# EAGLE design untitled (EAGLE 7.2.0)
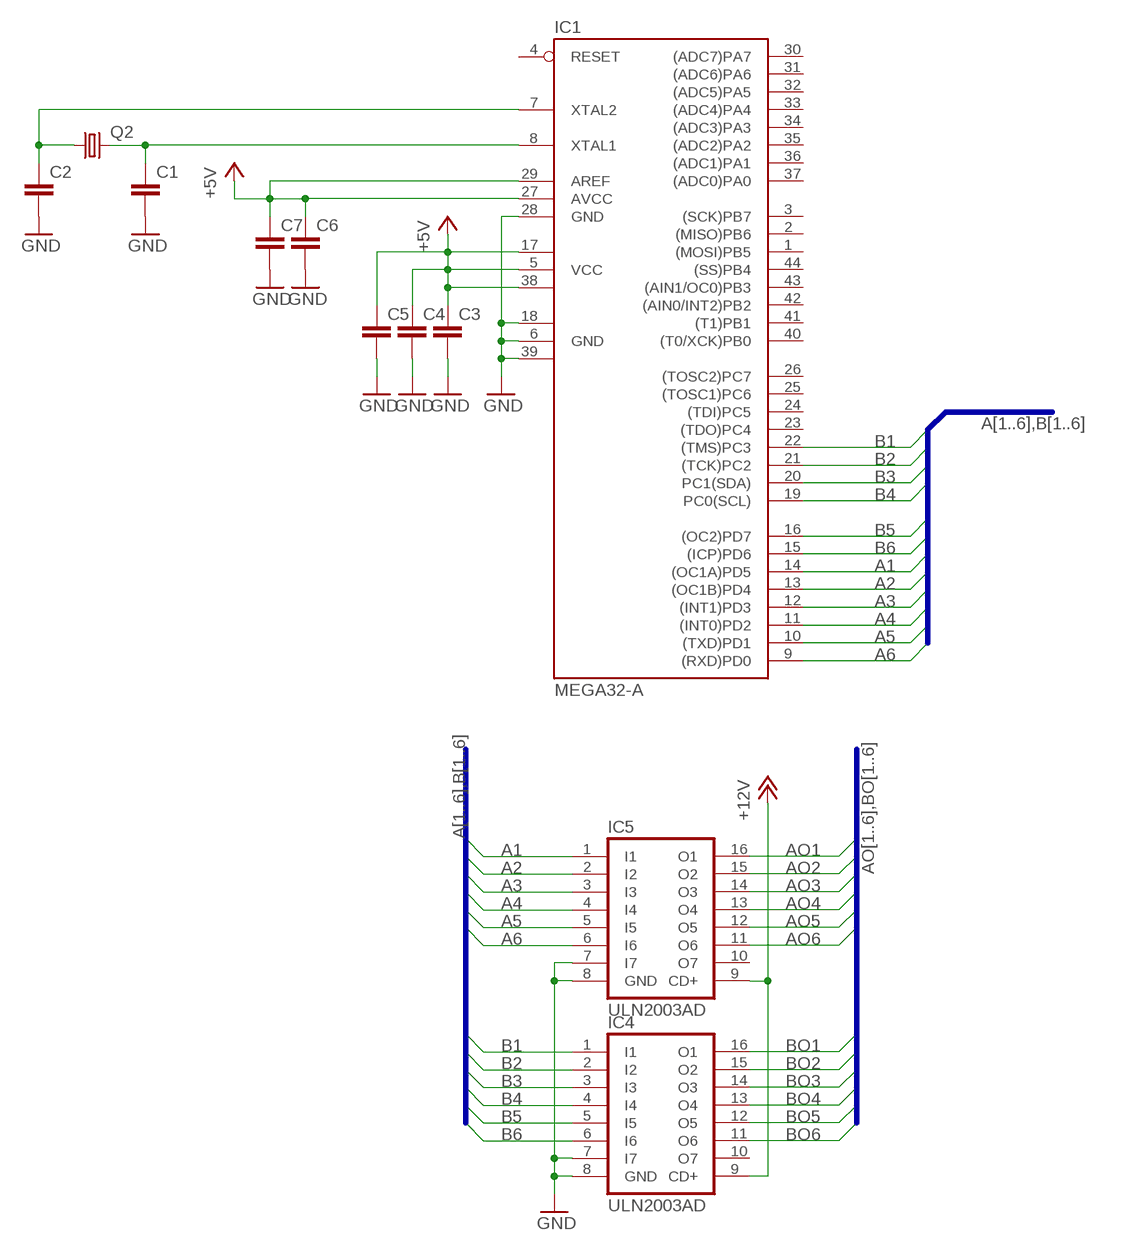
[diagram p0: schematic, sheet 1]

## Parts
C1  C-EUC0805K  [C0805K]
C2  C-EUC0805K  [C0805K]
C3  C-EUC0805K  [C0805K]
C4  C-EUC0805K  [C0805K]
C5  C-EUC0805K  [C0805K]
C6  C-EUC0805K  [C0805K]
C7  C-EUC0805K  [C0805K]
IC1  MEGA32-A  [TQFP44]
IC4  ULN2003AD  [SO16]
IC5  ULN2003AD  [SO16]
Q2  CRYSTALSM49  [SM49]

## Nets
+5V: C3.1 C4.1 C5.1 C6.1 C7.1 IC1.5(VCC) IC1.17(VCC1) IC1.27(AVCC) IC1.29(AREF) IC1.38(VCC2)
+12V: IC4.9(CD+) IC5.9(CD+)
A1: IC1.14((OC1A)PD5) IC5.1(I1)
A2: IC1.13((OC1B)PD4) IC5.2(I2)
A3: IC1.12((INT1)PD3) IC5.3(I3)
A4: IC1.11((INT0)PD2) IC5.4(I4)
A5: IC1.10((TXD)PD1) IC5.5(I5)
A6: IC1.9((RXD)PD0) IC5.6(I6)
AO1: IC5.16(O1)
AO2: IC5.15(O2)
AO3: IC5.14(O3)
AO4: IC5.13(O4)
AO5: IC5.12(O5)
AO6: IC5.11(O6)
B1: IC1.22((TMS)PC3) IC4.1(I1)
B2: IC1.21((TCK)PC2) IC4.2(I2)
B3: IC1.20(PC1(SDA)) IC4.3(I3)
B4: IC1.19(PC0(SCL)) IC4.4(I4)
B5: IC1.16((OC2)PD7) IC4.5(I5)
B6: IC1.15((ICP)PD6) IC4.6(I6)
BO1: IC4.16(O1)
BO2: IC4.15(O2)
BO3: IC4.14(O3)
BO4: IC4.13(O4)
BO5: IC4.12(O5)
BO6: IC4.11(O6)
GND: C1.2 C2.2 C3.2 C4.2 C5.2 C6.2 C7.2 IC1.6(GND) IC1.18(GND1) IC1.28(GND) IC1.39(GND2) IC4.7(I7) IC4.8(GND) IC5.7(I7) IC5.8(GND)
N$1: C2.1 IC1.7(XTAL2) Q2.1
N$2: C1.1 IC1.8(XTAL1) Q2.2
Unconnected: IC1.1((MOSI)PB5) IC1.2((MISO)PB6) IC1.3((SCK)PB7) IC1.4(RESET) IC1.23((TDO)PC4) IC1.24((TDI)PC5) IC1.25((TOSC1)PC6) IC1.26((TOSC2)PC7) IC1.30((ADC7)PA7) IC1.31((ADC6)PA6) IC1.32((ADC5)PA5) IC1.33((ADC4)PA4) IC1.34((ADC3)PA3) IC1.35((ADC2)PA2) IC1.36((ADC1)PA1) IC1.37((ADC0)PA0) IC1.40((T0/XCK)PB0) IC1.41((T1)PB1) IC1.42((AIN0/INT2)PB2) IC1.43((AIN1/OC0)PB3) IC1.44((SS)PB4) IC4.10(O7) IC5.10(O7)

## Buses
A[1..6],B[1..6]
AO[1..6],BO[1..6]

## Library data of the parts
C1-C7 = rcl:C-EU: CAPACITOR, European symbol
IC1 = atmel:MEGA32: MICROCONTROLLER 32 Kbytes FLASH 2 Kbytes SRAM 1 Kbytes EEPROM USART 8-channel 10 bit ADC Source: www.atmel.com .. doc2503.pdf; MPN: ATMEGA32-16AU; OC_FARNELL: 9171274; OC_NEWARK: 69K6677
IC4 IC5 = uln-udn:ULN2003A: DRIVER ARRAY
Q2 = crystal:CRYSTAL: CRYSTAL; OC_FARNELL: unknown; OC_NEWARK: unknown

## Board
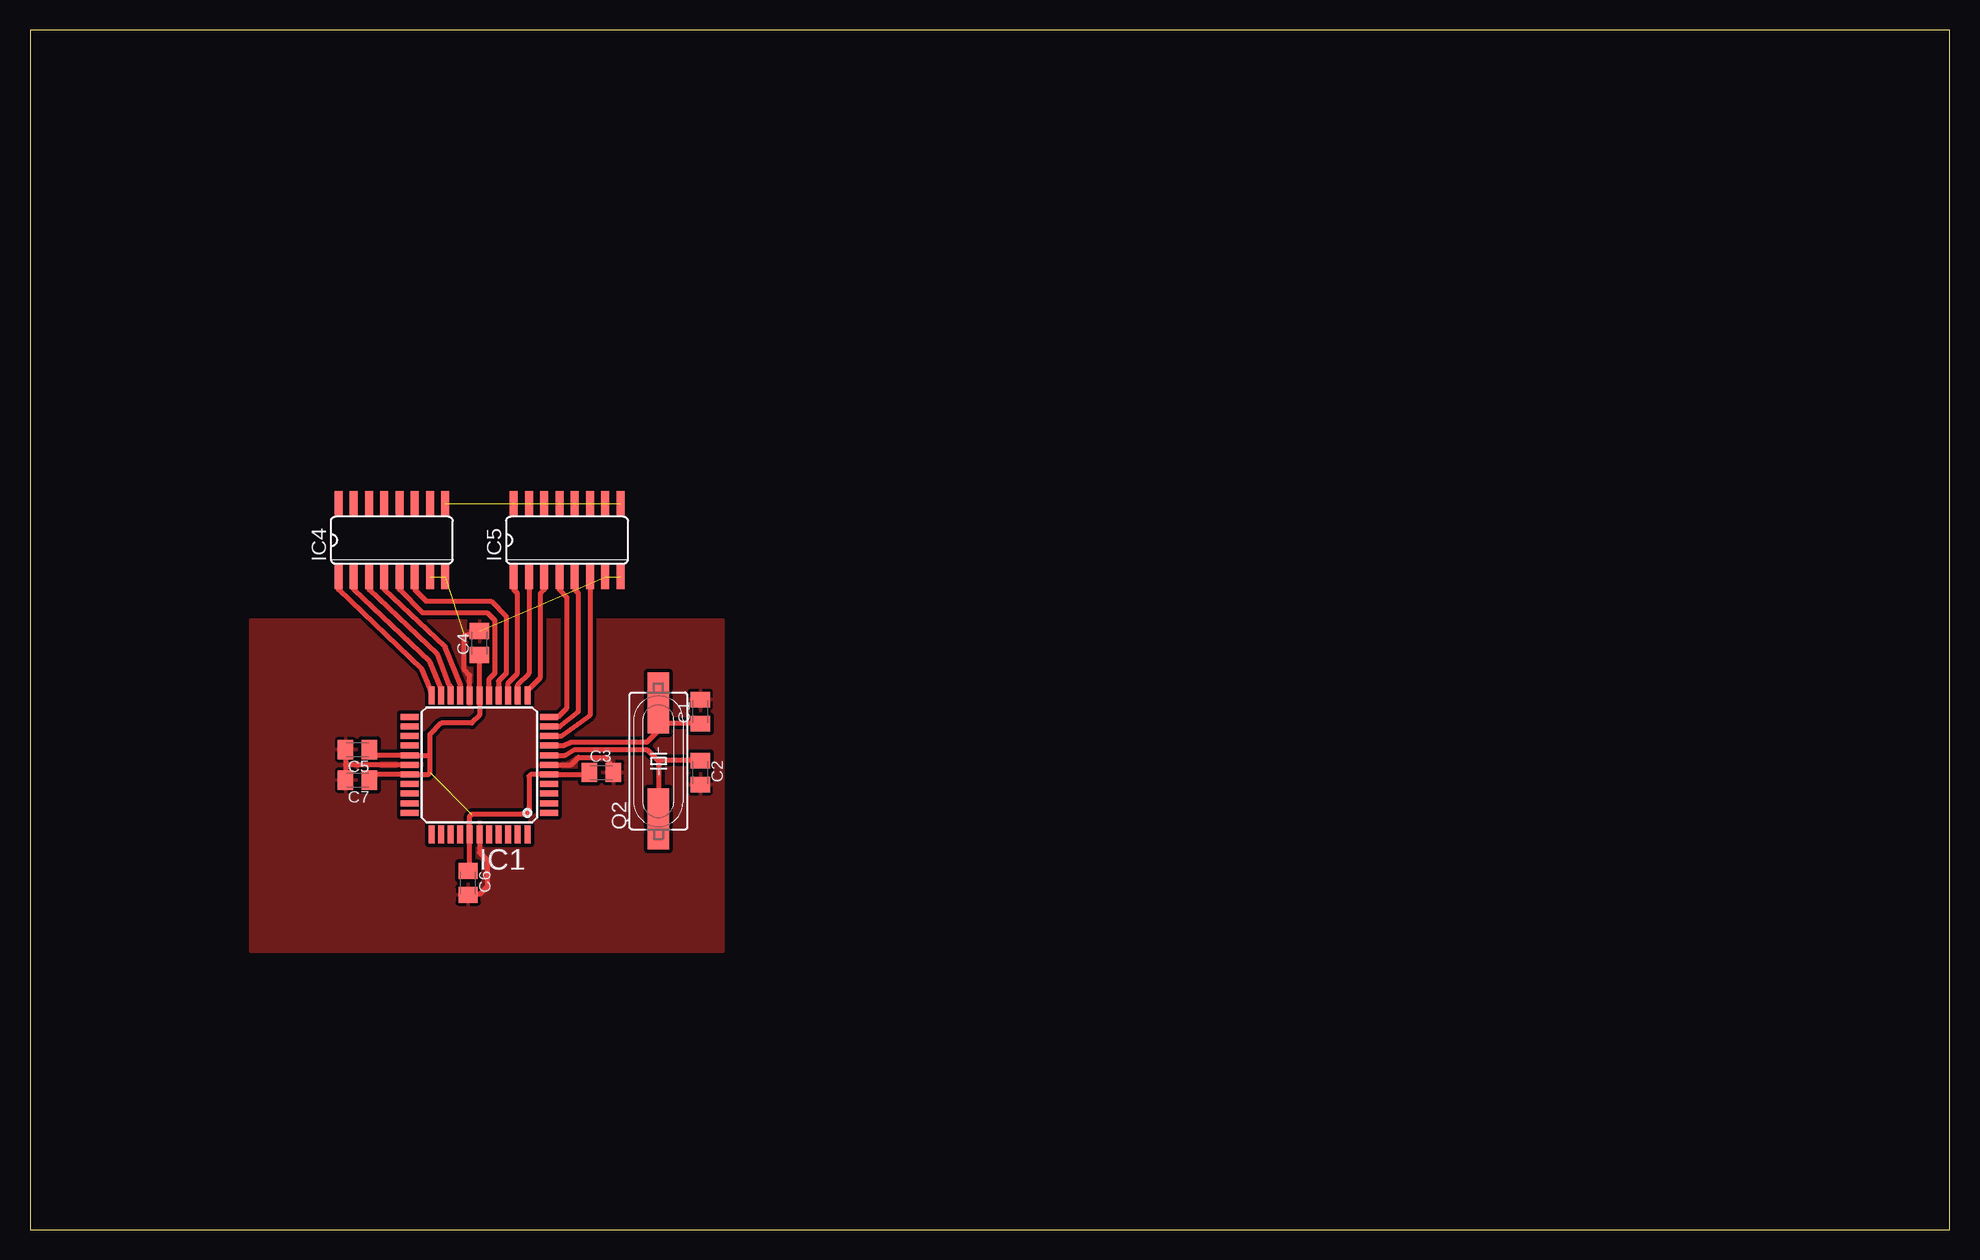
[diagram p1: board, top side]

Size 160 x 100 mm. Coordinates in mm from the lower left corner, seen from the top.
Outline: 0,0 160,0 160,100 0,100 0,0
Copper layers (1*16): Top 0.035mm / dielectric 1.5mm / Bottom 0.035mm
Design rules "default": minimum track width 10mil, minimum drill 24mil, track to track 8mil, track to pad 8mil, pad to pad 8mil, via to via 8mil, smd to smd 8mil, copper to edge 40mil, drill to drill 8mil, minimum pad ring 10mil, minimum via ring 8mil, stop-mask expansion 4mil, vias tented up to drill 0mil, thermal gap 10mil

### Footprints (pad centres in the part's own frame; a part is rotated, then mirrored left to right if it is on the bottom)
C0805K = smd 1.3 x 1.6: 1 -1,0; 2 1,0
TQFP44 = smd 1.5 x 0.5: 1 -5.8,4; 2 -5.8,3.2; 3 -5.8,2.4; 4 -5.8,1.6; 5 -5.8,0.8; 6 -5.8,0; 7 -5.8,-0.8; 8 -5.8,-1.6; 9 -5.8,-2.4; 10 -5.8,-3.2; 11 -5.8,-4; 23 5.8,-4; 24 5.8,-3.2; 25 5.8,-2.4; 26 5.8,-1.6; 27 5.8,-0.8; 28 5.8,0; 29 5.8,0.8; 30 5.8,1.6; 31 5.8,2.4; 32 5.8,3.2; 33 5.8,4 | smd 0.5 x 1.5: 12 -4,-5.8; 13 -3.2,-5.8; 14 -2.4,-5.8; 15 -1.6,-5.8; 16 -0.8,-5.8; 17 0,-5.8; 18 0.8,-5.8; 19 1.6,-5.8; 20 2.4,-5.8; 21 3.2,-5.8; 22 4,-5.8; 34 4,5.8; 35 3.2,5.8; 36 2.4,5.8; 37 1.6,5.8; 38 0.8,5.8; 39 0,5.8; 40 -0.8,5.8; 41 -1.6,5.8; 42 -2.4,5.8; 43 -3.2,5.8; 44 -4,5.8
SO16 = smd 0.66 x 2.032: 1 -4.445,-3.073; 2 -3.175,-3.073; 3 -1.905,-3.073; 4 -0.635,-3.073; 5 0.635,-3.073; 6 1.905,-3.073; 7 3.175,-3.073; 8 4.445,-3.073; 9 4.445,3.073; 10 3.175,3.073; 11 1.905,3.073; 12 0.635,3.073; 13 -0.635,3.073; 14 -1.905,3.073; 15 -3.175,3.073; 16 -4.445,3.073
SM49 = smd 5.08 x 1.778: 1 -4.826,0; 2 4.826,0

### Placement (x,y rotation side)
C1  55.88,43.18 90 top
C2  55.88,38.1 270 top
C3  47.62,38.1 0 top
C4  37.47,48.9 90 top
C5  27.3,40.01 180 top
C6  36.51,28.89 270 top
C7  27.3,37.47 180 top
IC1  37.47,38.73 180 top
IC4  30.16,57.47 0 top
IC5  44.77,57.47 0 top
Q2  52.39,39.05 90 top

### Tracks (layer width: path | path; a pad name or v marks a point on that pad's centre or on a via)
+5V  (1 unrouted)
  Top 0.406: C4.1 IC1.17 37.47,42.86 36.83,42.23 34.29,42.23 33.34,41.27 33.34,39.53 | C3.1 46.62,37.94 IC1.5 41.74,37.94 41.59,37.78 41.59,34.92 41.27,34.61 36.83,34.61 36.66,34.44 IC1.38 36.66,29.89 C6.1 | C5.1 28.3,39.53 IC1.27 33.34,39.53 | C7.1 28.3,37.94 IC1.29 33.17,37.94 33.34,38.1 33.34,39.53
+12V  (1 unrouted)
A1
  Top 0.406: IC1.14 39.87,45.58 40.64,46.35 40.64,53.02 40.32,53.34 IC5.1
A2
  Top 0.406: IC1.13 40.66,45.43 41.59,46.35 IC5.2
A3
  Top 0.406: IC1.12 41.47,44.96 42.55,46.04 42.55,53.02 42.86,53.34 IC5.3
A4
  Top 0.406: IC1.11 44.01,42.73 44.77,43.5 44.77,52.7 44.13,53.34 IC5.4
A5
  Top 0.406: IC1.10 44.16,41.94 45.72,43.18 45.72,53.02 45.4,53.34 IC5.5
A6
  Top 0.406: IC1.9 44.31,41.13 46.67,42.86 IC5.6
B1
  Top 0.406: IC1.22 33.34,45.09 32.7,46.67 25.72,53.34 IC4.1
B2
  Top 0.406: IC1.21 34.27,45.06 34.29,45.09 33.34,47.31 26.99,53.34 IC4.2
B3
  Top 0.406: IC1.20 35.06,45.26 34.92,45.4 33.97,47.94 28.26,53.34 IC4.3
B4
  Top 0.406: IC1.19 35.88,45.4 34.61,48.58 29.53,53.34 IC4.4
B5
  Top 0.406: IC1.16 38.27,45.88 38.73,46.35 38.73,50.8 38.1,51.44 32.7,51.44 30.8,53.34 IC4.5
B6
  Top 0.406: IC1.15 39.05,44.55 39.05,45.72 39.69,46.35 39.69,51.12 38.42,52.39 33.02,52.39 32.07,53.34 IC4.6
GND  (4 unrouted)
  Top 0.406: C5.2 26.3,38.73 | 26.3,38.73 C7.2 | IC1.28 26.3,38.73 | IC1.39 37.47,31.43 38.1,30.8 38.1,28.57 37.47,27.94 36.56,27.94 C6.2 | IC1.6 45.09,38.73 45.72,39.37 47.94,39.37 48.26,39.05 48.26,38.47 C3.2 | IC1.18 36.66,46.2 36.2,46.67 36.2,49.53 C4.2
  pour Top (isolate 0.305): 18.41,50.8 57.78,50.8 57.78,23.18 18.41,23.18
N$1
  Top 0.406: IC1.7 44.62,39.53 45.4,40.01 51.44,40.01 52.39,39.05 | 52.39,39.05 Q2.1 | C2.1 52.44,39.1 52.39,39.05
N$2
  Top 0.406: IC1.8 44.46,40.34 45.09,40.64 51.44,40.64 52.39,41.59 52.39,42.23 | 52.39,42.23 Q2.2 | C1.1 52.44,42.18 52.39,42.23